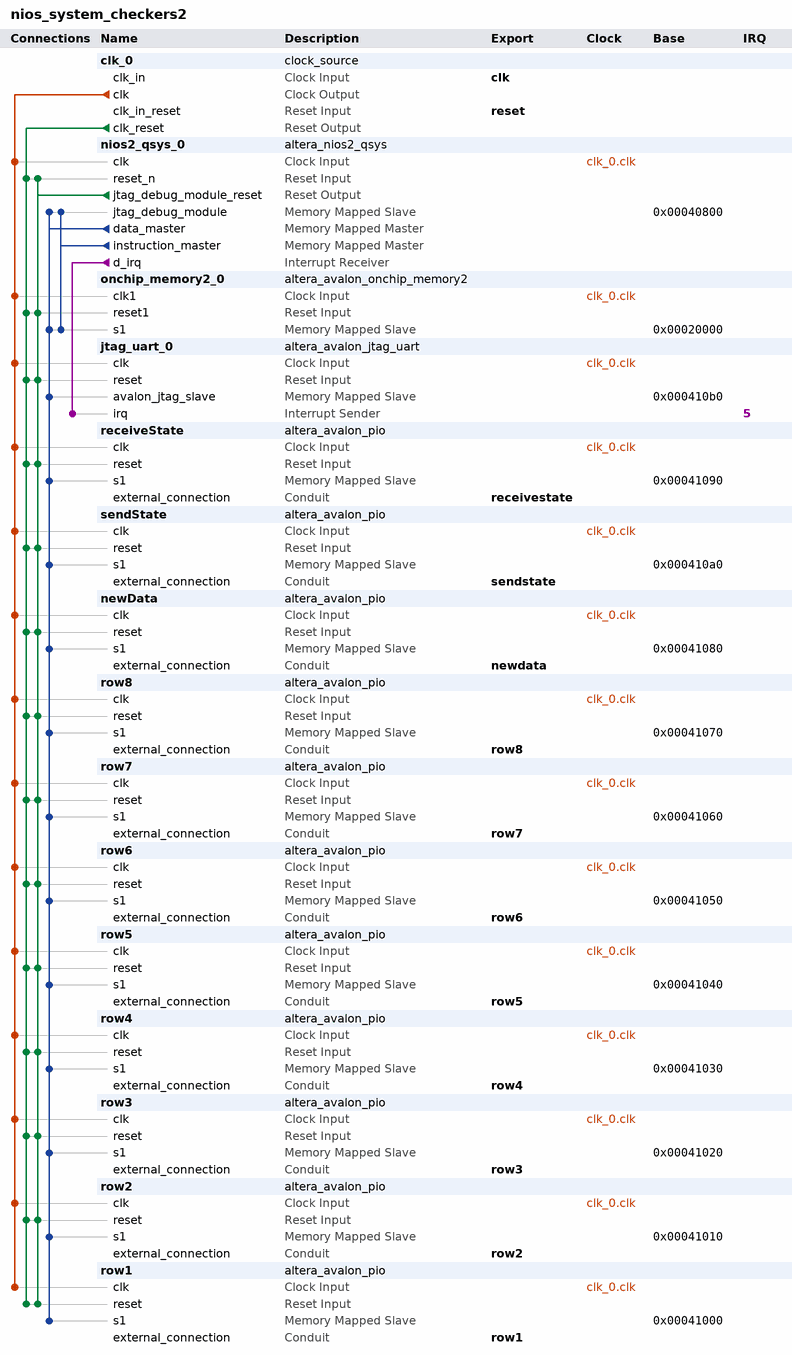
[diagram p0: system contents]
# Platform Designer (Qsys) system nios_system_checkers2, Cyclone V 5CSEMA5F31C6
# Parameters at their usual value, and those the tool derives, are not listed.
package require -exact qsys 14.0
create_system nios_system_checkers2
set_project_property DEVICE_FAMILY {Cyclone V}
set_project_property DEVICE 5CSEMA5F31C6

add_instance clk_0 clock_source 14.0
set_instance_parameter_value clk_0 clockFrequency 50000000

add_instance nios2_qsys_0 altera_nios2_qsys 14.0
set_instance_parameter_value nios2_qsys_0 resetrequest_enabled true
set_instance_parameter_value nios2_qsys_0 resetSlave onchip_memory2_0.s1
set_instance_parameter_value nios2_qsys_0 mmu_TLBMissExcSlave None
set_instance_parameter_value nios2_qsys_0 exceptionSlave onchip_memory2_0.s1
set_instance_parameter_value nios2_qsys_0 breakSlave nios2_qsys_0.jtag_debug_module
set_instance_parameter_value nios2_qsys_0 impl Tiny
set_instance_parameter_value nios2_qsys_0 icache_size 4096

add_instance onchip_memory2_0 altera_avalon_onchip_memory2 14.0
set_instance_parameter_value onchip_memory2_0 dataWidth 32
set_instance_parameter_value onchip_memory2_0 dualPort false
set_instance_parameter_value onchip_memory2_0 initMemContent true
set_instance_parameter_value onchip_memory2_0 initializationFileName onchip_mem.hex
set_instance_parameter_value onchip_memory2_0 memorySize 131072

add_instance jtag_uart_0 altera_avalon_jtag_uart 14.0
set_instance_parameter_value jtag_uart_0 simInteractiveOptions NO_INTERACTIVE_WINDOWS

add_instance receiveState altera_avalon_pio 14.0
set_instance_parameter_value receiveState direction Input
set_instance_parameter_value receiveState width 1

add_instance sendState altera_avalon_pio 14.0
set_instance_parameter_value sendState direction Output
set_instance_parameter_value sendState width 1

add_instance newData altera_avalon_pio 14.0
set_instance_parameter_value newData direction Input
set_instance_parameter_value newData width 1

add_instance row8 altera_avalon_pio 14.0
set_instance_parameter_value row8 direction InOut
set_instance_parameter_value row8 width 32

add_instance row7 altera_avalon_pio 14.0
set_instance_parameter_value row7 direction InOut
set_instance_parameter_value row7 width 32

add_instance row6 altera_avalon_pio 14.0
set_instance_parameter_value row6 direction InOut
set_instance_parameter_value row6 width 32

add_instance row5 altera_avalon_pio 14.0
set_instance_parameter_value row5 direction InOut
set_instance_parameter_value row5 width 32

add_instance row4 altera_avalon_pio 14.0
set_instance_parameter_value row4 direction InOut
set_instance_parameter_value row4 width 32

add_instance row3 altera_avalon_pio 14.0
set_instance_parameter_value row3 direction InOut
set_instance_parameter_value row3 width 32

add_instance row2 altera_avalon_pio 14.0
set_instance_parameter_value row2 direction InOut
set_instance_parameter_value row2 width 32

add_instance row1 altera_avalon_pio 14.0
set_instance_parameter_value row1 direction InOut
set_instance_parameter_value row1 width 32

# connections
add_connection clk_0.clk jtag_uart_0.clk clock
add_connection clk_0.clk newData.clk clock
add_connection clk_0.clk nios2_qsys_0.clk clock
add_connection clk_0.clk onchip_memory2_0.clk1 clock
add_connection clk_0.clk receiveState.clk clock
add_connection clk_0.clk row1.clk clock
add_connection clk_0.clk row2.clk clock
add_connection clk_0.clk row3.clk clock
add_connection clk_0.clk row4.clk clock
add_connection clk_0.clk row5.clk clock
add_connection clk_0.clk row6.clk clock
add_connection clk_0.clk row7.clk clock
add_connection clk_0.clk row8.clk clock
add_connection clk_0.clk sendState.clk clock
add_connection clk_0.clk_reset jtag_uart_0.reset reset
add_connection clk_0.clk_reset newData.reset reset
add_connection clk_0.clk_reset nios2_qsys_0.reset_n reset
add_connection clk_0.clk_reset onchip_memory2_0.reset1 reset
add_connection clk_0.clk_reset receiveState.reset reset
add_connection clk_0.clk_reset row1.reset reset
add_connection clk_0.clk_reset row2.reset reset
add_connection clk_0.clk_reset row3.reset reset
add_connection clk_0.clk_reset row4.reset reset
add_connection clk_0.clk_reset row5.reset reset
add_connection clk_0.clk_reset row6.reset reset
add_connection clk_0.clk_reset row7.reset reset
add_connection clk_0.clk_reset row8.reset reset
add_connection clk_0.clk_reset sendState.reset reset
add_connection nios2_qsys_0.jtag_debug_module_reset jtag_uart_0.reset reset
add_connection nios2_qsys_0.jtag_debug_module_reset newData.reset reset
add_connection nios2_qsys_0.jtag_debug_module_reset nios2_qsys_0.reset_n reset
add_connection nios2_qsys_0.jtag_debug_module_reset onchip_memory2_0.reset1 reset
add_connection nios2_qsys_0.jtag_debug_module_reset receiveState.reset reset
add_connection nios2_qsys_0.jtag_debug_module_reset row1.reset reset
add_connection nios2_qsys_0.jtag_debug_module_reset row2.reset reset
add_connection nios2_qsys_0.jtag_debug_module_reset row3.reset reset
add_connection nios2_qsys_0.jtag_debug_module_reset row4.reset reset
add_connection nios2_qsys_0.jtag_debug_module_reset row5.reset reset
add_connection nios2_qsys_0.jtag_debug_module_reset row6.reset reset
add_connection nios2_qsys_0.jtag_debug_module_reset row7.reset reset
add_connection nios2_qsys_0.jtag_debug_module_reset row8.reset reset
add_connection nios2_qsys_0.jtag_debug_module_reset sendState.reset reset
add_connection nios2_qsys_0.data_master jtag_uart_0.avalon_jtag_slave avalon
set_connection_parameter_value nios2_qsys_0.data_master/jtag_uart_0.avalon_jtag_slave baseAddress 0x000410b0
add_connection nios2_qsys_0.data_master newData.s1 avalon
set_connection_parameter_value nios2_qsys_0.data_master/newData.s1 baseAddress 0x00041080
add_connection nios2_qsys_0.data_master nios2_qsys_0.jtag_debug_module avalon
set_connection_parameter_value nios2_qsys_0.data_master/nios2_qsys_0.jtag_debug_module baseAddress 0x00040800
add_connection nios2_qsys_0.data_master onchip_memory2_0.s1 avalon
set_connection_parameter_value nios2_qsys_0.data_master/onchip_memory2_0.s1 baseAddress 0x00020000
add_connection nios2_qsys_0.data_master receiveState.s1 avalon
set_connection_parameter_value nios2_qsys_0.data_master/receiveState.s1 baseAddress 0x00041090
add_connection nios2_qsys_0.data_master row1.s1 avalon
set_connection_parameter_value nios2_qsys_0.data_master/row1.s1 baseAddress 0x00041000
add_connection nios2_qsys_0.data_master row2.s1 avalon
set_connection_parameter_value nios2_qsys_0.data_master/row2.s1 baseAddress 0x00041010
add_connection nios2_qsys_0.data_master row3.s1 avalon
set_connection_parameter_value nios2_qsys_0.data_master/row3.s1 baseAddress 0x00041020
add_connection nios2_qsys_0.data_master row4.s1 avalon
set_connection_parameter_value nios2_qsys_0.data_master/row4.s1 baseAddress 0x00041030
add_connection nios2_qsys_0.data_master row5.s1 avalon
set_connection_parameter_value nios2_qsys_0.data_master/row5.s1 baseAddress 0x00041040
add_connection nios2_qsys_0.data_master row6.s1 avalon
set_connection_parameter_value nios2_qsys_0.data_master/row6.s1 baseAddress 0x00041050
add_connection nios2_qsys_0.data_master row7.s1 avalon
set_connection_parameter_value nios2_qsys_0.data_master/row7.s1 baseAddress 0x00041060
add_connection nios2_qsys_0.data_master row8.s1 avalon
set_connection_parameter_value nios2_qsys_0.data_master/row8.s1 baseAddress 0x00041070
add_connection nios2_qsys_0.data_master sendState.s1 avalon
set_connection_parameter_value nios2_qsys_0.data_master/sendState.s1 baseAddress 0x000410a0
add_connection nios2_qsys_0.instruction_master nios2_qsys_0.jtag_debug_module avalon
set_connection_parameter_value nios2_qsys_0.instruction_master/nios2_qsys_0.jtag_debug_module baseAddress 0x00040800
add_connection nios2_qsys_0.instruction_master onchip_memory2_0.s1 avalon
set_connection_parameter_value nios2_qsys_0.instruction_master/onchip_memory2_0.s1 baseAddress 0x00020000
add_connection nios2_qsys_0.d_irq jtag_uart_0.irq interrupt
set_connection_parameter_value nios2_qsys_0.d_irq/jtag_uart_0.irq irqNumber 5

# exported interfaces
add_interface clk clock sink
set_interface_property clk EXPORT_OF clk_0.clk_in
add_interface reset reset sink
set_interface_property reset EXPORT_OF clk_0.clk_in_reset
add_interface sendstate conduit end
set_interface_property sendstate EXPORT_OF sendState.external_connection
add_interface receivestate conduit end
set_interface_property receivestate EXPORT_OF receiveState.external_connection
add_interface newdata conduit end
set_interface_property newdata EXPORT_OF newData.external_connection
add_interface row8 conduit end
set_interface_property row8 EXPORT_OF row8.external_connection
add_interface row7 conduit end
set_interface_property row7 EXPORT_OF row7.external_connection
add_interface row6 conduit end
set_interface_property row6 EXPORT_OF row6.external_connection
add_interface row5 conduit end
set_interface_property row5 EXPORT_OF row5.external_connection
add_interface row4 conduit end
set_interface_property row4 EXPORT_OF row4.external_connection
add_interface row3 conduit end
set_interface_property row3 EXPORT_OF row3.external_connection
add_interface row2 conduit end
set_interface_property row2 EXPORT_OF row2.external_connection
add_interface row1 conduit end
set_interface_property row1 EXPORT_OF row1.external_connection

set_interconnect_requirement {$system} qsys_mm.clockCrossingAdapter HANDSHAKE
set_interconnect_requirement {$system} qsys_mm.maxAdditionalLatency 1
set_interconnect_requirement {$system} qsys_mm.enableEccProtection FALSE
set_interconnect_requirement {$system} qsys_mm.insertDefaultSlave FALSE

save_system nios_system_checkers2.qsys
